# Altium schematic sheet 07_EL_CON.SchDoc
size A3
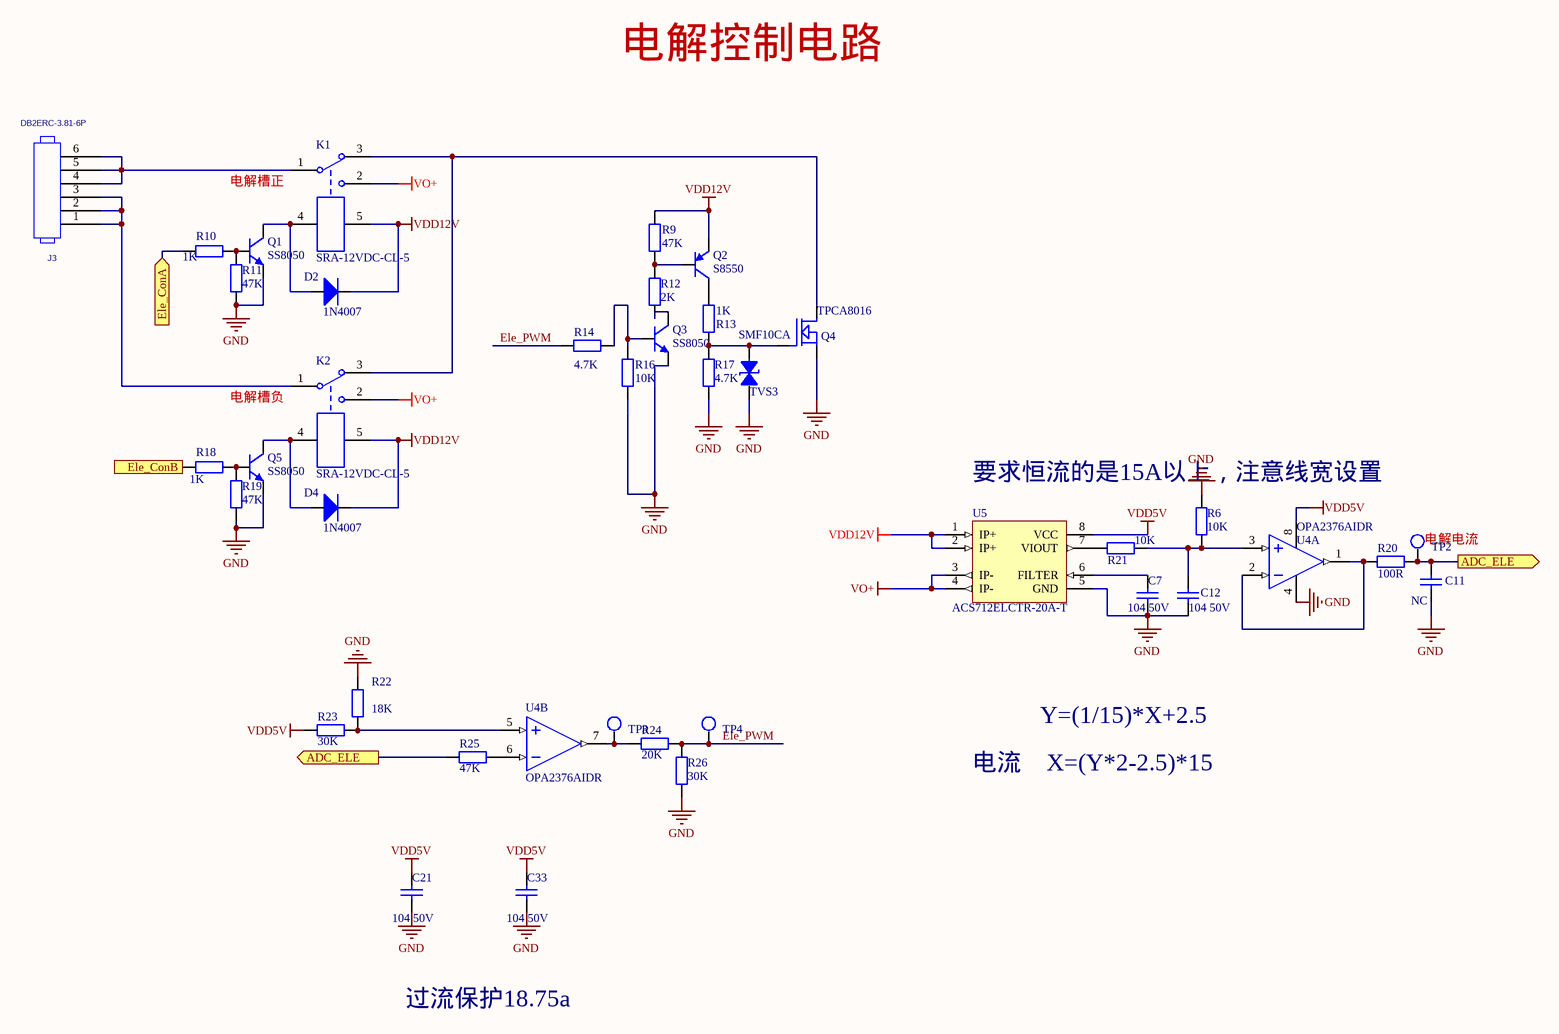
[diagram p0: 07_EL_CON.SchDoc]

## Parts
C7  104 50V  [SMD-0603C]
C11  NC  [SMD-0603C]
C12  104 50V  [SMD-0603C]
C21  104 50V  [SMD-0603C]
C33  104 50V  [SMD-0603C]
D2  1N4007  [DO-214-AC]
D4  1N4007  [DO-214-AC]
J3  value DB2ERC-3.81-6P  [DB2ERC-3P81-6P]  (hidden comment: HEADER_6)
K1  SRA-12VDC-CL-5  [SRA- 12V]
K2  SRA-12VDC-CL-5  [SRA- 12V]
Q1  SS8050  [SOT-23]
Q2  S8550  [SOT-23]
Q3  SS8050  [SOT-23]
Q4  TPCA8016  [DFN-8 5X6]
Q5  SS8050  [SOT-23]
R6  10K  [SMD-0603]
R9  47K  [SMD-0603]
R10  1K  [SMD-0603]
R11  47K  [SMD-0603]
R12  2K  [SMD-0603]
R13  1K  [SMD-0603]
R14  4.7K  [SMD-0603]
R16  10K  [SMD-0603]
R17  4.7K  [SMD-0603]
R18  1K  [SMD-0603]
R19  47K  [SMD-0603]
R20  100R  [SMD-0603]
R21  10K  [SMD-0603]
R22  18K  [SMD-0603]
R23  30K  [SMD-0603]
R24  20K  [SMD-0603]
R25  47K  [SMD-0603]
R26  30K  [SMD-0603]
TP2  TPS  [tpd]  (value not drawn)
TP3  TPS  [tpd]  (value not drawn)
TP4  TPS  [tpd]  (value not drawn)
TVS3  SMF10CA  [SOD-123]
U4  OPA2376AIDR  [SOIC-8]  (parts A,B of 2)
U5  ACS712ELCTR-20A-T  [SO-8]

## Ports
ADC_ELE (out), Ele_ConA (in), Ele_ConB (in)

## Nets
GND: C7.2 C11.1 C12.2 C21.1 C33.1 Q1.2(E) Q3.2(E) Q4.3(S) Q5.2(E) R6.1 R11.1 R16.1 R17.2 R19.1 R22.2 R26.2 TVS3.1(A) U4.4(V-) U5.5(GND)
VDD5V: C21.2 C33.2 R23.2 U4.8(V+) U5.8(VCC)
VDD12V: D2.2(K) D4.2(K) K1.5 K2.5 Q2.2(E) R9.2 U5.1(IP+) U5.2(IP+)
VO+: K1.2 K2.2 U5.3(IP-) U5.4(IP-)
ADC_ELE: C11.2 R20.1 R25.2 TP2.1 ; port ADC_ELE
Ele_ConA: R10.1 ; port Ele_ConA
Ele_ConB: R18.1 ; port Ele_ConB
Ele_PWM: R14.2 R24.1 R26.1 TP4.1
NetC7_1: C7.1 U5.6(FILTER)
NetC12_1: C12.1 R6.2 R21.1 U4.3(IN1+)
NetD2_1: D2.1(A) K1.4 Q1.3(C)
NetD4_1: D4.1(A) K2.4 Q5.3(C)
NetJ3_1: J3.1 J3.2 J3.3 K2.1
NetJ3_4: J3.4 J3.5 J3.6 K1.1
NetK1_3: K1.3 K2.3 Q4.2(D)
NetQ1_1: Q1.1(B) R10.2 R11.2
NetQ2_1: Q2.1(B) R9.1 R12.1
NetQ2_3: Q2.3(C) R13.2
NetQ3_1: Q3.1(B) R14.1 R16.2
NetQ3_3: Q3.3(C) R12.2
NetQ4_1: Q4.1(G) R13.1 R17.1 TVS3.2(B)
NetQ5_1: Q5.1(B) R18.2 R19.2
NetR20_2: R20.2 U4.1(OUT1) U4.2(IN1-)
NetR21_2: R21.2 U5.7(VIOUT)
NetR22_1: R22.1 R23.1 U4.5(IN2+)
NetR24_2: R24.2 TP3.1 U4.7(OUT2)
NetR25_1: R25.1 U4.6(IN2-)

## Notes on the sheet
- 电解控制电路
- 电解槽正
- 电解槽负
- (near R6) 要求恒流的是15A以上，注意线宽设置
- (near TP2) 电解电流
- Y=(1/15)*X+2.5
- 电流
- X=(Y*2-2.5)*15
- 过流保护18.75a

## Library data of the parts
C7 = C: 贴片电容 10%
C11 C12 = CAP4: 贴片电容 10%
C21 C33 = CAP4: 贴片电容 20%
D2 D4 = DIODE2: 贴片二极管
J3 = HEADER_6: Source_Path: C:\MYPROGRAM\CADENCE\SPB_16.6\TOOLS\CAPTURE\LIBRARY\CONNECTOR.OLB; PCB DECAL: DB2ERC-3P81-6P
K1 K2 = JDQ1: 5V 继电器
Q1 Q3 Q5 = NPN-1: 三极管
Q2 = PNP
Q4 = SI7860
R6 R21 = RES0: 贴片电阻 1%
R9 R12-R14 R16 R17 R22-R26 = RES-SOP: 贴片电阻 5%
R10 R11 R18 R19 = RES2: 贴片电阻 5%
R20 = RES0: 贴片电阻 5%
TVS3 = TVS-1: TVS 10V
U4 = LM358: 运算放大器
U5 = ACS712: HALL 20A 电流传感器